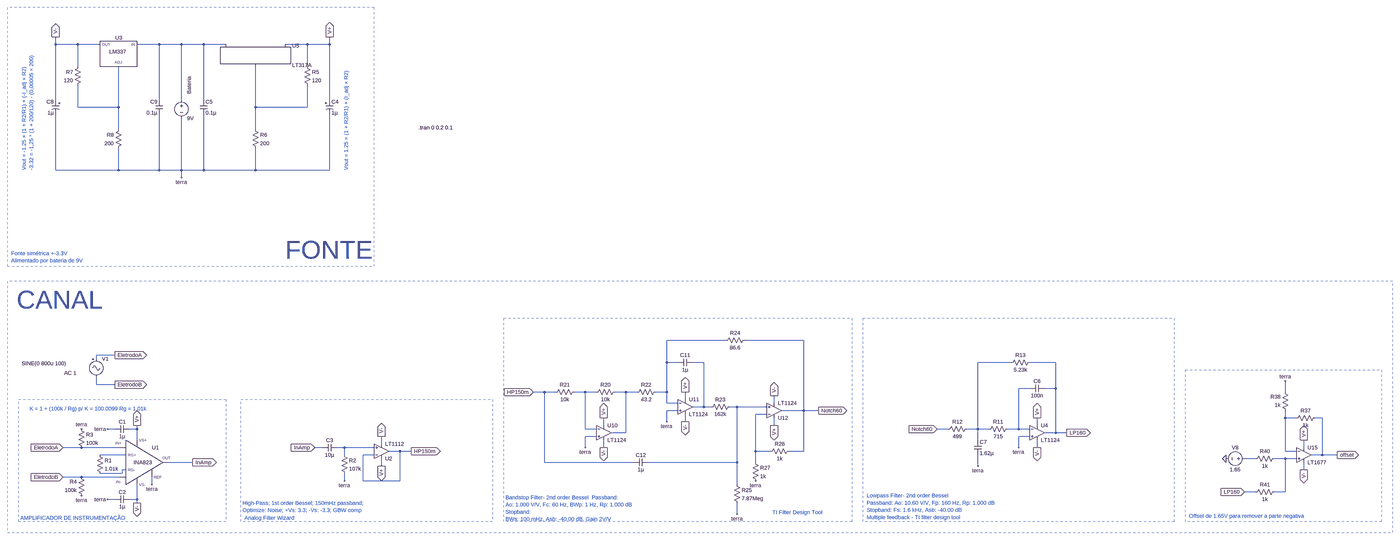
[diagram p0: schematic canal_teste_fonte.asc, whole sheet]
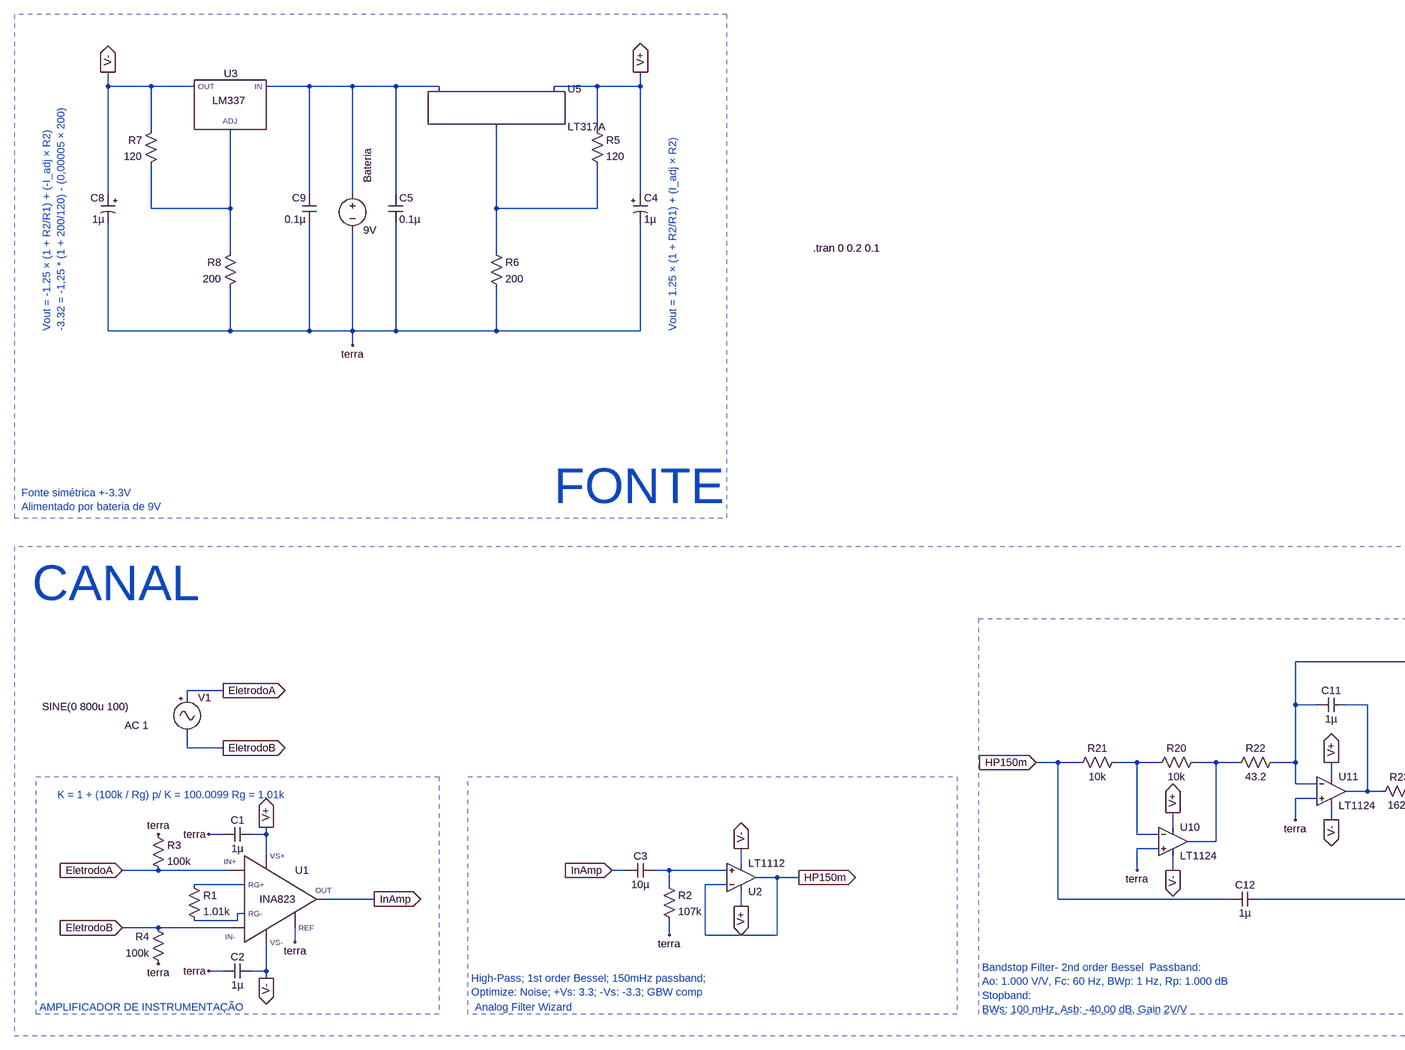
[diagram p1: schematic canal_teste_fonte.asc, part, row 1 of 1, column 1 of 2]
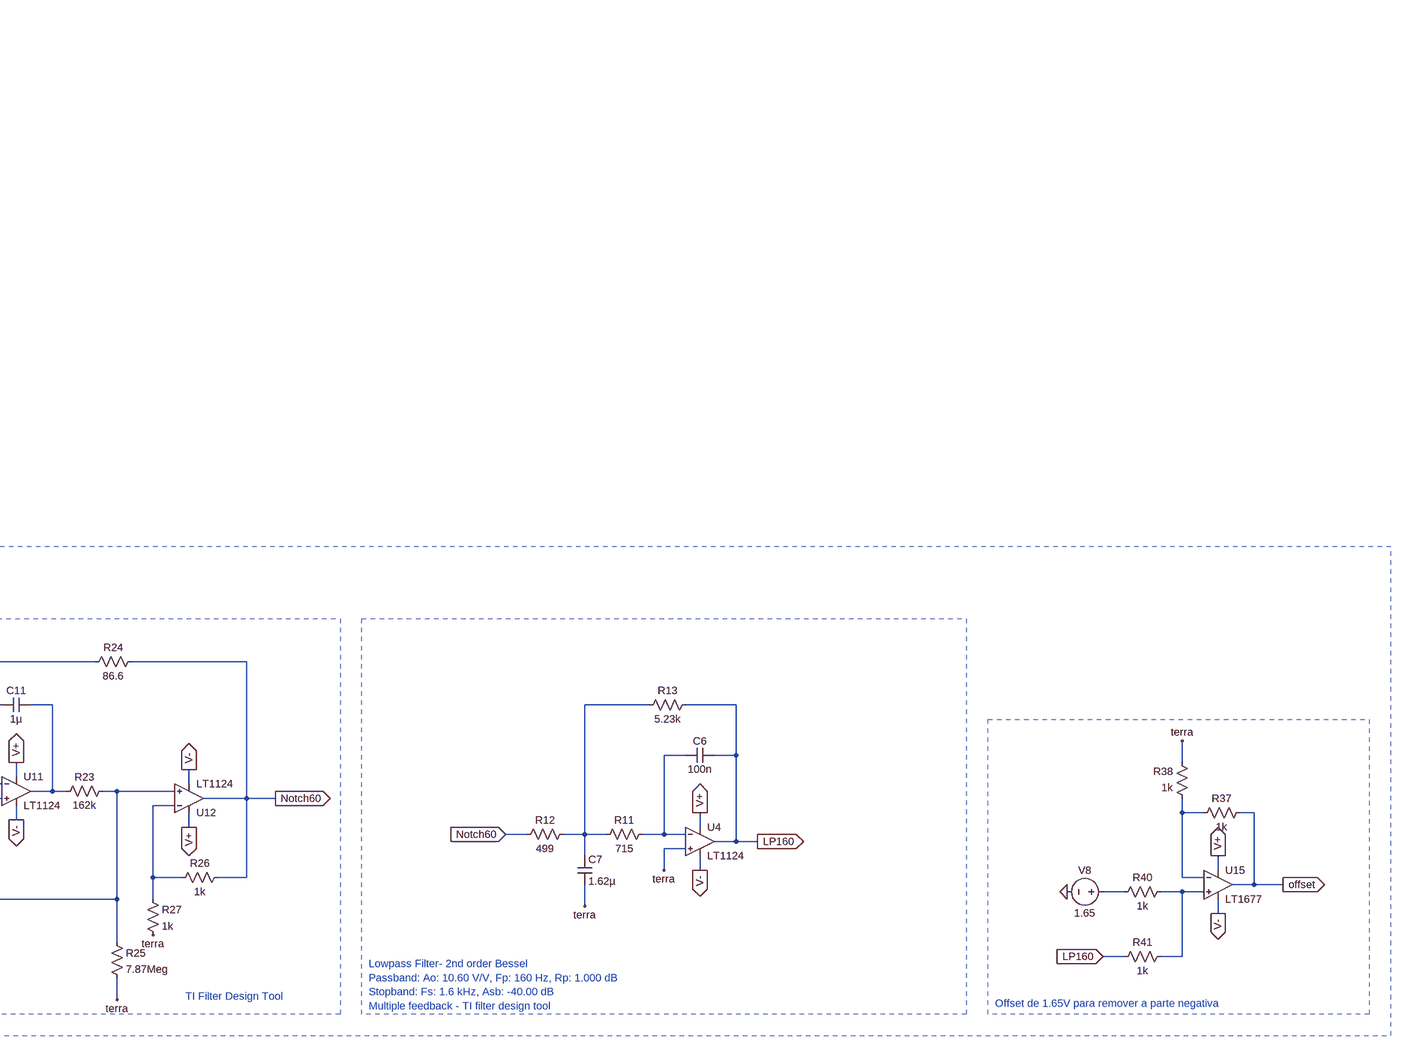
[diagram p2: schematic canal_teste_fonte.asc, part, row 1 of 1, column 2 of 2]
canal_teste_fonte.asc, the LTspice schematic file:
Version 4
SHEET 1 6804 2324
WIRE -736 -1456 -736 -1488
WIRE -640 -1456 -736 -1456
WIRE -544 -1456 -640 -1456
WIRE -288 -1456 -384 -1456
WIRE -192 -1456 -288 -1456
WIRE -96 -1456 -192 -1456
WIRE 0 -1456 -96 -1456
WIRE 352 -1456 256 -1456
WIRE 448 -1456 448 -1488
WIRE 448 -1456 352 -1456
WIRE -640 -1360 -640 -1456
WIRE 352 -1360 352 -1456
WIRE -736 -1216 -736 -1456
WIRE -288 -1216 -288 -1456
WIRE -192 -1216 -192 -1456
WIRE -96 -1216 -96 -1456
WIRE 448 -1216 448 -1456
WIRE -640 -1184 -640 -1280
WIRE -464 -1184 -464 -1360
WIRE -464 -1184 -640 -1184
WIRE 128 -1184 128 -1360
WIRE 352 -1184 352 -1280
WIRE 352 -1184 128 -1184
WIRE -464 -1088 -464 -1184
WIRE 128 -1088 128 -1184
WIRE -736 -912 -736 -1152
WIRE -464 -912 -464 -1008
WIRE -464 -912 -736 -912
WIRE -288 -912 -288 -1152
WIRE -288 -912 -464 -912
WIRE -192 -912 -192 -1136
WIRE -192 -912 -288 -912
WIRE -96 -912 -96 -1152
WIRE -96 -912 -192 -912
WIRE 128 -912 128 -1008
WIRE 128 -912 -96 -912
WIRE 448 -912 448 -1152
WIRE 448 -912 128 -912
WIRE -192 -880 -192 -912
WIRE 2160 -176 1904 -176
WIRE 2496 -176 2240 -176
WIRE -480 -112 -560 -112
WIRE -560 -96 -560 -112
WIRE 1904 -80 1904 -176
WIRE 1952 -80 1904 -80
WIRE 2064 -80 2016 -80
WIRE 3392 -80 3248 -80
WIRE 3584 -80 3472 -80
WIRE -560 16 -560 -16
WIRE -480 16 -560 16
WIRE 3472 32 3424 32
WIRE 3584 32 3584 -80
WIRE 3584 32 3536 32
WIRE 1376 48 1328 48
WIRE 1424 48 1376 48
WIRE 1552 48 1504 48
WIRE 1600 48 1552 48
WIRE 1728 48 1680 48
WIRE 1776 48 1728 48
WIRE 1904 48 1904 -80
WIRE 1904 48 1856 48
WIRE 4576 48 4576 0
WIRE 1984 80 1984 48
WIRE 1904 96 1904 48
WIRE 1952 96 1904 96
WIRE 2368 96 2368 64
WIRE 2064 112 2064 -80
WIRE 2064 112 2016 112
WIRE 2096 112 2064 112
WIRE 2208 112 2176 112
WIRE 2336 112 2208 112
WIRE 1952 128 1904 128
WIRE 2496 128 2496 -176
WIRE 2496 128 2400 128
WIRE 2560 128 2496 128
WIRE 2336 144 2288 144
WIRE 4576 160 4576 128
WIRE 4624 160 4576 160
WIRE 4736 160 4704 160
WIRE 1904 176 1904 128
WIRE 1984 176 1984 144
WIRE 1632 192 1632 160
WIRE 2368 192 2368 160
WIRE 3504 192 3504 160
WIRE -480 208 -512 208
WIRE -384 208 -384 192
WIRE -384 208 -416 208
WIRE 1552 208 1552 48
WIRE 1600 208 1552 208
WIRE 3120 208 3072 208
WIRE 3248 208 3248 -80
WIRE 3248 208 3200 208
WIRE 3296 208 3248 208
WIRE 3424 208 3424 32
WIRE 3424 208 3376 208
WIRE 3472 208 3424 208
WIRE 1728 224 1728 48
WIRE 1728 224 1664 224
WIRE 3584 224 3584 32
WIRE 3584 224 3536 224
WIRE 3632 224 3584 224
WIRE 1600 240 1552 240
WIRE 3472 240 3424 240
WIRE -384 256 -384 208
WIRE 3248 256 3248 208
WIRE 672 272 672 240
WIRE -624 288 -704 288
WIRE -464 288 -624 288
WIRE 416 288 384 288
WIRE 512 288 480 288
WIRE 640 288 512 288
WIRE 1552 288 1552 240
WIRE 1632 288 1632 256
WIRE 3424 288 3424 240
WIRE 3504 288 3504 256
WIRE 4656 288 4656 256
WIRE 752 304 704 304
WIRE 800 304 752 304
WIRE 2288 304 2288 144
WIRE 2352 304 2288 304
WIRE 2496 304 2496 128
WIRE 2496 304 2432 304
WIRE 4576 304 4576 160
WIRE 4624 304 4576 304
WIRE -432 320 -544 320
WIRE 512 320 512 288
WIRE 640 320 592 320
WIRE 4736 320 4736 160
WIRE 4736 320 4688 320
WIRE 4800 320 4736 320
WIRE 4448 336 4400 336
WIRE 4576 336 4528 336
WIRE 4624 336 4576 336
WIRE -144 352 -256 352
WIRE 1376 352 1376 48
WIRE 1760 352 1376 352
WIRE 2208 352 2208 112
WIRE 2208 352 1824 352
WIRE 2288 352 2288 304
WIRE 672 368 672 336
WIRE 3248 368 3248 320
WIRE -432 384 -448 384
WIRE 4656 384 4656 352
WIRE -448 400 -448 384
WIRE -448 400 -544 400
WIRE -624 416 -704 416
WIRE -464 416 -624 416
WIRE 512 432 512 400
WIRE 592 432 592 320
WIRE 752 432 752 304
WIRE 752 432 592 432
WIRE -320 448 -320 416
WIRE 2208 448 2208 352
WIRE 4448 480 4400 480
WIRE 4576 480 4576 336
WIRE 4576 480 4528 480
WIRE -480 512 -512 512
WIRE -384 512 -384 448
WIRE -384 512 -416 512
WIRE -384 528 -384 512
WIRE 2208 576 2208 528
FLAG -624 208 terra
FLAG -624 496 terra
FLAG -480 16 EletrodoB
IOPIN -480 16 Out
FLAG -704 288 EletrodoA
IOPIN -704 288 In
FLAG -704 416 EletrodoB
IOPIN -704 416 In
FLAG -144 352 InAmp
IOPIN -144 352 Out
FLAG -384 528 V-
IOPIN -384 528 Out
FLAG -384 192 V+
IOPIN -384 192 Out
FLAG -320 448 terra
FLAG -512 208 terra
FLAG -512 512 terra
FLAG 672 368 V+
IOPIN 672 368 Out
FLAG 672 240 V-
IOPIN 672 240 Out
FLAG 512 432 terra
FLAG 384 288 InAmp
IOPIN 384 288 In
FLAG 800 304 HP150m
IOPIN 800 304 Out
FLAG -480 -112 EletrodoA
IOPIN -480 -112 Out
FLAG 1552 288 terra
FLAG 1632 160 V+
IOPIN 1632 160 Out
FLAG 1632 288 V-
IOPIN 1632 288 Out
FLAG 1984 48 V+
IOPIN 1984 48 Out
FLAG 1984 176 V-
IOPIN 1984 176 Out
FLAG 1904 176 terra
FLAG 1328 48 HP150m
IOPIN 1328 48 In
FLAG 2368 192 V+
IOPIN 2368 192 Out
FLAG 2368 64 V-
IOPIN 2368 64 Out
FLAG 2208 576 terra
FLAG 2560 128 Notch60
IOPIN 2560 128 Out
FLAG 2288 432 terra
FLAG 3504 160 V+
IOPIN 3504 160 Out
FLAG 3504 288 V-
IOPIN 3504 288 Out
FLAG 3248 368 terra
FLAG 3072 208 Notch60
IOPIN 3072 208 In
FLAG 3424 288 terra
FLAG 3632 224 LP160
IOPIN 3632 224 Out
FLAG 4656 384 V-
IOPIN 4656 384 Out
FLAG 4656 256 V+
IOPIN 4656 256 Out
FLAG 4320 336 0
FLAG 4400 480 LP160
IOPIN 4400 480 In
FLAG 4576 0 terra
FLAG 4800 320 offset
IOPIN 4800 320 Out
FLAG 448 -1488 V+
IOPIN 448 -1488 Out
FLAG -736 -1488 V-
IOPIN -736 -1488 Out
FLAG -192 -880 terra
SYMBOL INA823 -368 352 R0
SYMATTR InstName U1
SYMBOL res -640 192 R0
SYMATTR InstName R3
SYMATTR Value 100k
SYMBOL res -608 512 R180
WINDOW 0 36 76 Left 2
WINDOW 3 36 40 Left 2
SYMATTR InstName R4
SYMATTR Value 100k
SYMBOL cap -416 192 R90
WINDOW 0 0 32 VBottom 2
WINDOW 3 32 32 VTop 2
SYMATTR InstName C1
SYMATTR Value 1µ
SYMBOL cap -416 496 R90
WINDOW 0 0 32 VBottom 2
WINDOW 3 32 32 VTop 2
SYMATTR InstName C2
SYMATTR Value 1µ
SYMBOL res -560 304 R0
SYMATTR InstName R1
SYMATTR Value 1.01k
SYMBOL Misc\\signal -560 -112 R0
WINDOW 3 -322 36 Left 2
WINDOW 123 -139 78 Left 2
WINDOW 39 0 0 Left 0
SYMATTR Value SINE(0 800u 100)
SYMATTR Value2 AC 1
SYMATTR InstName V1
SYMBOL OpAmps\\LT1112 672 368 M180
SYMATTR InstName U2
SYMBOL res 496 304 R0
SYMATTR InstName R2
SYMATTR Value 107k
SYMBOL cap 480 272 R90
WINDOW 0 0 32 VBottom 2
WINDOW 3 32 32 VTop 2
SYMATTR InstName C3
SYMATTR Value 10µ
SYMBOL res 1696 32 R90
WINDOW 0 0 56 VBottom 2
WINDOW 3 32 56 VTop 2
SYMATTR InstName R20
SYMATTR Value 10k
SYMBOL res 1520 32 R90
WINDOW 0 0 56 VBottom 2
WINDOW 3 32 56 VTop 2
SYMATTR InstName R21
SYMATTR Value 10k
SYMBOL res 1872 32 R90
WINDOW 0 0 56 VBottom 2
WINDOW 3 32 56 VTop 2
SYMATTR InstName R22
SYMATTR Value 43.2
SYMBOL cap 2016 -96 R90
WINDOW 0 0 32 VBottom 2
WINDOW 3 32 32 VTop 2
SYMATTR InstName C11
SYMATTR Value 1µ
SYMBOL res 2192 96 R90
WINDOW 0 0 56 VBottom 2
WINDOW 3 32 56 VTop 2
SYMATTR InstName R23
SYMATTR Value 162k
SYMBOL cap 1824 336 R90
WINDOW 0 0 32 VBottom 2
WINDOW 3 32 32 VTop 2
SYMATTR InstName C12
SYMATTR Value 1µ
SYMBOL res 2256 -192 R90
WINDOW 0 0 56 VBottom 2
WINDOW 3 32 56 VTop 2
SYMATTR InstName R24
SYMATTR Value 86.6
SYMBOL res 2192 432 R0
SYMATTR InstName R25
SYMATTR Value 7.87Meg
SYMBOL OpAmps\\LT1124 1632 160 R0
SYMATTR InstName U10
SYMBOL OpAmps\\LT1124 1984 48 R0
SYMATTR InstName U11
SYMBOL OpAmps\\LT1124 2368 192 M180
SYMATTR InstName U12
SYMBOL res 2448 288 R90
WINDOW 0 0 56 VBottom 2
WINDOW 3 32 56 VTop 2
SYMATTR InstName R26
SYMATTR Value 1k
SYMBOL res 2272 336 R0
SYMATTR InstName R27
SYMATTR Value 1k
SYMBOL OpAmps\\LT1124 3504 160 R0
SYMATTR InstName U4
SYMBOL cap 3536 16 R90
WINDOW 0 0 32 VBottom 2
WINDOW 3 32 32 VTop 2
SYMATTR InstName C6
SYMATTR Value 100n
SYMBOL res 3392 192 R90
WINDOW 0 0 56 VBottom 2
WINDOW 3 32 56 VTop 2
SYMATTR InstName R11
SYMATTR Value 715
SYMBOL cap 3232 256 R0
SYMATTR InstName C7
SYMATTR Value 1.62µ
SYMBOL res 3216 192 R90
WINDOW 0 0 56 VBottom 2
WINDOW 3 32 56 VTop 2
SYMATTR InstName R12
SYMATTR Value 499
SYMBOL res 3488 -96 R90
WINDOW 0 0 56 VBottom 2
WINDOW 3 32 56 VTop 2
SYMATTR InstName R13
SYMATTR Value 5.23k
SYMBOL OpAmps\\LT1677 4656 256 R0
SYMATTR InstName U15
SYMBOL res 4544 320 R90
WINDOW 0 0 56 VBottom 2
WINDOW 3 32 56 VTop 2
SYMATTR InstName R40
SYMATTR Value 1k
SYMBOL res 4544 464 R90
WINDOW 0 0 56 VBottom 2
WINDOW 3 32 56 VTop 2
SYMATTR InstName R41
SYMATTR Value 1k
SYMBOL voltage 4416 336 R90
WINDOW 0 -32 56 VBottom 2
WINDOW 3 32 56 VTop 2
WINDOW 123 0 0 Left 0
WINDOW 39 0 0 Left 0
SYMATTR InstName V8
SYMATTR Value 1.65
SYMBOL res 4720 144 R90
WINDOW 0 0 56 VBottom 2
WINDOW 3 32 56 VTop 2
SYMATTR InstName R37
SYMATTR Value 1k
SYMBOL res 4592 144 R180
WINDOW 0 36 76 Left 2
WINDOW 3 36 40 Left 2
SYMATTR InstName R38
SYMATTR Value 1k
SYMBOL PowerProducts\\LT317A 128 -1456 R0
SYMATTR InstName U5
SYMBOL res 336 -1376 R0
SYMATTR InstName R5
SYMATTR Value 120
SYMBOL res 112 -1104 R0
SYMATTR InstName R6
SYMATTR Value 200
SYMBOL cap -112 -1216 R0
SYMATTR InstName C5
SYMATTR Value 0.1µ
SYMBOL polcap 432 -1216 R0
SYMATTR InstName C4
SYMATTR Value 1µ
SYMBOL voltage -192 -1232 R0
WINDOW 0 34 -9 VLeft 2
SYMATTR InstName Bateria
SYMATTR Value 9V
SYMBOL LM337 -464 -1424 M0
SYMATTR InstName U3
SYMBOL res -624 -1376 M0
SYMATTR InstName R7
SYMATTR Value 120
SYMBOL res -448 -1104 M0
SYMATTR InstName R8
SYMATTR Value 200
SYMBOL polcap -720 -1216 M0
SYMATTR InstName C8
SYMATTR Value 1µ
SYMBOL cap -272 -1216 M0
SYMATTR InstName C9
SYMATTR Value 0.1µ
TEXT -848 120 Left 2 ;K = 1 + (100k / Rg) p/ K = 100.0099 Rg = 1.01k
TEXT -888 592 Left 2 ;AMPLIFICADOR DE INSTRUMENTAÇÃO
TEXT 832 -1096 Left 2 !.tran 0 0.2 0.1
TEXT 72 528 Left 2 ;High-Pass; 1st order Bessel; 150mHz passband; \nOptimize: Noise; +Vs: 3.3; -Vs: -3.3; GBW comp
TEXT 80 592 Left 2 ;Analog Filter Wizard
TEXT 1208 504 Left 2 ;Bandstop Filter- 2nd order Bessel  Passband:\nAo: 1.000 V/V, Fc: 60 Hz, BWp: 1 Hz, Rp: 1.000 dB\nStopband:\nBWs: 100 mHz, Asb: -40.00 dB, Gain 2V/V
TEXT 2360 568 Left 2 ;TI Filter Design Tool
TEXT 2768 496 Left 2 ;Lowpass Filter- 2nd order Bessel\nPassband: Ao: 10.60 V/V, Fp: 160 Hz, Rp: 1.000 dB\nStopband: Fs: 1.6 kHz, Asb: -40.00 dB\nMultiple feedback - TI filter design tool
TEXT 4160 584 Left 2 ;Offset de 1.65V para remover a parte negativa
TEXT 520 -912 VLeft 2 ;Vout = 1.25 × (1 + R2/R1) + (I_adj × R2)
TEXT -872 -912 VLeft 2 ;Vout = -1.25 × (1 + R2/R1) + (-I_adj × R2)\n-3.32 = -1,25 * (1 + 200/120) - (0,00005 × 200)
TEXT -928 -552 Left 2 ;Fonte simétrica +-3.3V\nAlimentado por bateria de 9V
TEXT 256 -568 Left 7 ;FONTE
TEXT -904 -352 Left 7 ;CANAL
RECTANGLE Normal 0 608 -896 80 2
RECTANGLE Normal 1152 608 64 80 2
RECTANGLE Normal 2704 608 1200 -272 2
RECTANGLE Normal 4096 608 2752 -272 2
RECTANGLE Normal 4992 608 4144 -48 2
RECTANGLE Normal -944 656 5040 -432 2
RECTANGLE Normal -944 -496 640 -1616 2

The netlist it stands for:
* canal_teste_fonte.asc
XU1 EletrodoA EletrodoB V+ V- InAmp terra N014 N017 INA823  ; pins IN+ IN- VS+ VS- OUT REF RG+ RG-
R3 terra EletrodoA 100k
R4 terra EletrodoB 100k
C1 V+ terra 1µ
C2 V- terra 1µ
R1 N014 N017 1.01k
V1 EletrodoA EletrodoB SINE(0 800u 100) AC 1
XU2 N013 HP150m V+ V- HP150m LT1112  ; pins In+ In- V+ V- OUT
R2 N013 terra 107k
C3 N013 InAmp 10µ
R20 N009 N008 10k
R21 N008 HP150m 10k
R22 N004 N009 43.2
C11 N005 N004 1µ
R23 N010 N005 162k
C12 N010 HP150m 1µ
R24 Notch60 N004 86.6
R25 N010 terra 7.87Meg
XU10 terra N008 V+ V- N009 LT1124  ; pins In+ In- V+ V- OUT
XU11 terra N004 V+ V- N005 LT1124  ; pins In+ In- V+ V- OUT
XU12 N010 N011 V+ V- Notch60 LT1124  ; pins In+ In- V+ V- OUT
R26 Notch60 N011 1k
R27 N011 terra 1k
XU4 terra N007 V+ V- LP160 LT1124  ; pins In+ In- V+ V- OUT
C6 LP160 N007 100n
R11 N007 N006 715
C7 N006 terra 1.62µ
R12 N006 Notch60 499
R13 LP160 N006 5.23k
XU15 N016 N012 V+ V- offset LT1677  ; pins In+ In- V+ V- OUT
R40 N016 N015 1k
R41 N016 LP160 1k
V8 N015 0 1.65
R37 offset N012 1k
R38 N012 terra 1k
XU5 N003 V+ N001 LT317A
R5 V+ N003 120
R6 N003 terra 200
C5 N001 terra 0.1µ
C4 V+ terra 1µ
V§Bateria N001 terra 9V
XU3 N001 N002 V- LM337  ; pins IN ADJ OUT
R7 V- N002 120
R8 N002 terra 200
C8 V- terra 1µ
C9 N001 terra 0.1µ
* K = 1 + (100k / Rg) p/ K = 100.0099 Rg = 1.01k
* AMPLIFICADOR DE INSTRUMENTAÇÃO
.tran 0 0.2 0.1
* High-Pass; 1st order Bessel; 150mHz passband;
* Optimize: Noise; +Vs: 3.3; -Vs: -3.3; GBW comp
* Analog Filter Wizard
* Bandstop Filter- 2nd order Bessel  Passband:
* Ao: 1.000 V/V, Fc: 60 Hz, BWp: 1 Hz, Rp: 1.000 dB
* Stopband:
* BWs: 100 mHz, Asb: -40.00 dB, Gain 2V/V
* TI Filter Design Tool
* Lowpass Filter- 2nd order Bessel
* Passband: Ao: 10.60 V/V, Fp: 160 Hz, Rp: 1.000 dB
* Stopband: Fs: 1.6 kHz, Asb: -40.00 dB
* Multiple feedback - TI filter design tool
* Offset de 1.65V para remover a parte negativa
* Vout = 1.25 × (1 + R2/R1) + (I_adj × R2)
* Vout = -1.25 × (1 + R2/R1) + (-I_adj × R2)
* -3.32 = -1,25 * (1 + 200/120) - (0,00005 × 200)
* Fonte simétrica +-3.3V
* Alimentado por bateria de 9V
* FONTE
* CANAL
.lib Z:\mnt\9a3f66c9-6d6d-4e50-b992-ca8f034e1022\Download\EEG\canal\INA823.LIB
.lib LTC.lib
.lib LM337.sub
.backanno
.end